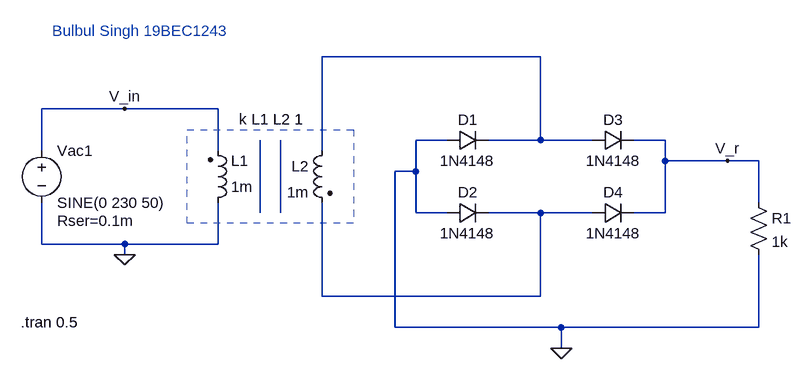
[diagram p0: schematic EXP4_TASK22 (1).asc]
EXP4_TASK22 (1).asc, the LTspice schematic file:
Version 4
SHEET 1 880 680
WIRE 432 -48 96 -48
WIRE -208 32 -336 32
WIRE -64 32 -208 32
WIRE 288 80 240 80
WIRE 432 80 432 -48
WIRE 432 80 352 80
WIRE 512 80 432 80
WIRE 624 80 576 80
WIRE -336 96 -336 32
WIRE -64 96 -64 32
WIRE 96 96 96 -48
WIRE 624 112 624 80
WIRE 720 112 624 112
WIRE 768 112 720 112
WIRE 240 128 240 80
WIRE 240 128 208 128
WIRE 768 176 768 112
WIRE 0 192 0 80
WIRE 32 192 32 80
WIRE 240 192 240 128
WIRE 288 192 240 192
WIRE 432 192 352 192
WIRE 512 192 432 192
WIRE 624 192 624 112
WIRE 624 192 576 192
WIRE -336 240 -336 176
WIRE -208 240 -336 240
WIRE -64 240 -64 176
WIRE -64 240 -208 240
WIRE -208 256 -208 240
WIRE 96 320 96 176
WIRE 432 320 432 192
WIRE 432 320 96 320
WIRE 208 368 208 128
WIRE 464 368 208 368
WIRE 768 368 768 256
WIRE 768 368 464 368
WIRE 464 400 464 368
FLAG -208 32 V_in
FLAG 720 112 V_r
FLAG -208 256 0
FLAG 464 400 0
SYMBOL ind2 -80 192 M180
WINDOW 0 36 80 Left 2
WINDOW 3 36 40 Left 2
SYMATTR InstName L1
SYMATTR Value 1m
SYMATTR Type ind
SYMBOL ind2 112 80 M0
SYMATTR InstName L2
SYMATTR Value 1m
SYMATTR Type ind
SYMBOL voltage -336 80 R0
WINDOW 123 0 0 Left 0
WINDOW 39 24 124 Left 2
SYMATTR SpiceLine Rser=0.1m
SYMATTR InstName Vac1
SYMATTR Value SINE(0 230 50)
SYMBOL diode 288 96 R270
WINDOW 0 32 32 VTop 2
WINDOW 3 0 32 VBottom 2
SYMATTR InstName D1
SYMATTR Value 1N4148
SYMBOL diode 288 208 R270
WINDOW 0 32 32 VTop 2
WINDOW 3 0 32 VBottom 2
SYMATTR InstName D2
SYMATTR Value 1N4148
SYMBOL diode 512 96 R270
WINDOW 0 32 32 VTop 2
WINDOW 3 0 32 VBottom 2
SYMATTR InstName D3
SYMATTR Value 1N4148
SYMBOL diode 512 208 R270
WINDOW 0 32 32 VTop 2
WINDOW 3 0 32 VBottom 2
SYMATTR InstName D4
SYMATTR Value 1N4148
SYMBOL res 752 160 R0
SYMATTR InstName R1
SYMATTR Value 1k
TEXT -32 48 Left 2 !k L1 L2 1
TEXT -320 -88 Left 2 ;Bulbul Singh 19BEC1243
TEXT -368 360 Left 2 !.tran 0.5
RECTANGLE Normal 144 208 -112 64 2

The netlist it stands for:
* EXP4_TASK22 (1).asc
L1 0 V_in 1m
L2 N001 N004 1m
Vac1 V_in 0 SINE(0 230 50) Rser=0.1m
D1 0 N001 1N4148
D2 0 N004 1N4148
D3 N001 V_r 1N4148
D4 N004 V_r 1N4148
R1 V_r 0 1k
.model D D
.lib standard.dio
k L1 L2 1
* Bulbul Singh 19BEC1243
.tran 0.5
.backanno
.end